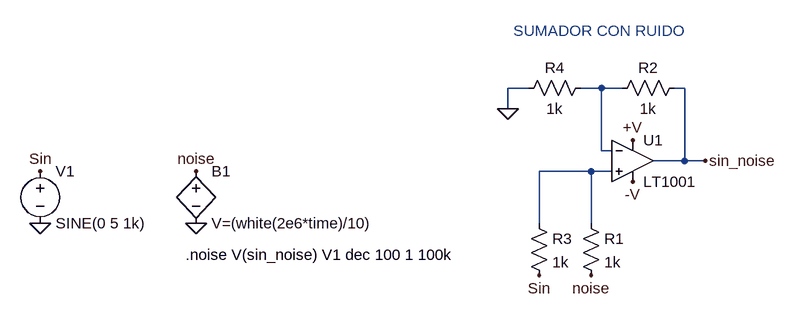
[diagram p0: schematic analisis_ruido.asc]
analisis_ruido.asc, the LTspice schematic file:
Version 4.1
SHEET 1 1276 680
WIRE -208 0 -240 0
WIRE -96 0 -128 0
WIRE -64 0 -96 0
WIRE 32 0 16 0
WIRE -240 32 -240 0
WIRE -96 96 -96 0
WIRE -80 96 -96 96
WIRE 32 112 32 0
WIRE 32 112 -16 112
WIRE 64 112 32 112
WIRE -112 128 -192 128
WIRE -80 128 -112 128
WIRE -192 208 -192 128
WIRE -112 208 -112 128
FLAG -48 144 -V
FLAG -48 80 +V
FLAG -720 128 noise
FLAG -112 288 noise
FLAG -720 208 0
FLAG -240 32 0
FLAG -192 288 Sin
FLAG 64 112 sin_noise
FLAG -960 208 0
FLAG -960 128 Sin
SYMBOL res -128 192 R0
SYMATTR InstName R1
SYMATTR Value 1k
SYMBOL bv -720 112 R0
SYMATTR InstName B1
SYMATTR Value V=(white(2e6*time)/10)
SYMBOL res 32 -16 R90
WINDOW 0 0 56 VBottom 2
WINDOW 3 32 56 VTop 2
SYMATTR InstName R2
SYMATTR Value 1k
SYMBOL res -208 192 R0
SYMATTR InstName R3
SYMATTR Value 1k
SYMBOL res -112 -16 R90
WINDOW 0 0 56 VBottom 2
WINDOW 3 32 56 VTop 2
SYMATTR InstName R4
SYMATTR Value 1k
SYMBOL opamps\\LT1001 -48 48 R0
SYMATTR InstName U1
SYMBOL voltage -960 112 R0
WINDOW 123 0 0 Left 0
WINDOW 39 0 0 Left 0
SYMATTR InstName V1
SYMATTR Value SINE(0 5 1k)
TEXT -232 -88 Left 2 ;SUMADOR CON RUIDO
TEXT -736 256 Left 2 !.noise V(sin_noise) V1 dec 100 1 100k

The netlist it stands for:
* analisis_ruido.asc
R1 N002 noise 1k
B1 noise 0 V=(white(2e6*time)/10)
R2 sin_noise N001 1k
R3 N002 Sin 1k
R4 N001 0 1k
X§U1 N002 N001 +V -V sin_noise LT1001  ; pins In+ In- V+ V- OUT
V1 Sin 0 SINE(0 5 1k)
* SUMADOR CON RUIDO
.noise V(sin_noise) V1 dec 100 1 100k
.lib LTC.lib
.backanno
.end